# EasyEDA Pro project ProPrj_Transistörle Led Kontrol Devresi_2025-12-10.epro

# Schematic Schematic1
Board Name: Board1; Create Date: 2025-12-10; Page Name: P1; Project Name: Transistörle Led Kontrol Devresi; Schematic Name: Schematic1; Update Date: 2025-12-10; Company: EasyEDA.com; Page Size: A4; Version: V1.0
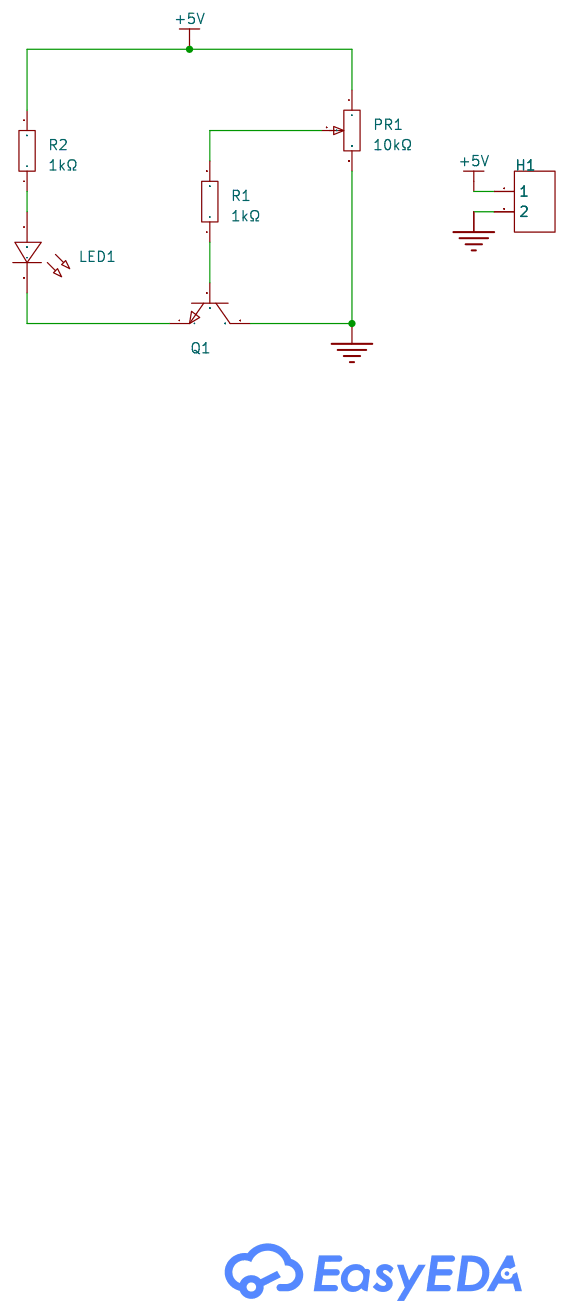
[diagram p0: schematic sheet]

## Parts
H1  -  [HDR-TH_2P-P2.54-V-F]
LED1  -  [LED_TH-3mm]
PR1  10kΩ  [R_3296]
Q1  -  [S8050_TO_92]
R1  1kΩ  [Res_1/4W]
R2  1kΩ  [Res_1/4W]

## Library data of the parts
H1 = HDR-F_2.54_1x2P: Holes Structure:1x2P Pitch:2.54mm Row Spacing:- Mounting Type:Straight Number of Rows:Plugin Number of Holes:2P Insulation Height:- Contact Material:- Contact Plating:-; Supplier Part: C49661; Supplier Footprint: 插件; Holes Structure: 1x2P; Pitch: 2.54mm; Mounting Type: Straight; Number of Rows: Plugin; Number of Holes: 2P; Supplier: LCSC; Manufacturer: BOOMELE(博穆精密); Manufacturer Part: 2.54-1*2P母; JLCPCB Part Class: Extended Part
LED1 = LED_TH-R_3mm: Supplier Footprint: 插件
PR1 = R_3296: Supplier Footprint: 直插
Q1 = S8050_TO_NPN: Supplier Footprint: TO-92
R1 R2 = Res_AXIAL-1/4W: Supplier Footprint: 轴向引线

## Nets
+5V: H1.1 PR1.1 R2.2
GND: H1.2 PR1.3 Q1.3(C)
Net-(LED1-1): LED1.1(C) R2.1
Net-(LED1-2): LED1.2(A) Q1.1(E)
Net-(PR1-2): PR1.2 R1.2
Net-(Q1-2): Q1.2(B) R1.1

# Board PCB1
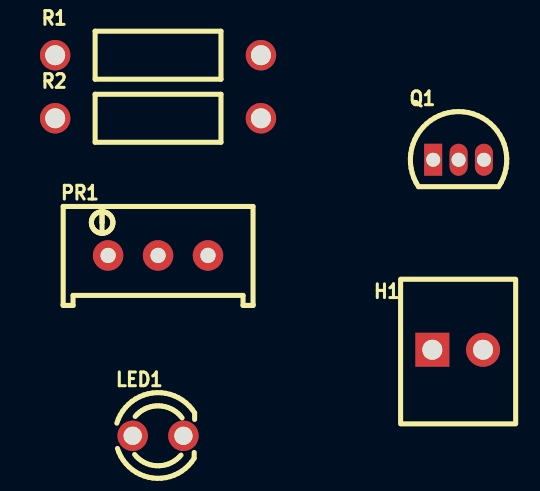
[diagram p1: board, top side]
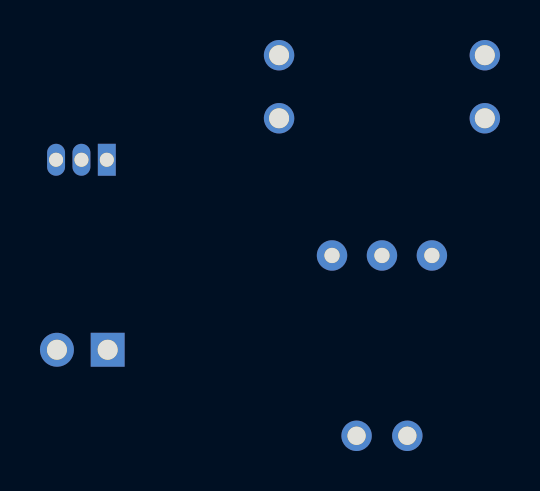
[diagram p2: board, bottom side, seen from below]

No outline. copper layers: Top Layer, Bottom Layer. Coordinates in mm from the lowest, leftmost part position.
Stack: Top Layer 0.035mm / Dielectric1 1.51mm FR4 er 4.5 / Bottom Layer 0.035mm

## Design rules (mm)
template: JLCPCB Capability(Two Layers Board)
spacing copperThickness1oz (default): track to track 0.102, other pairs 0.152 to 0.3
spacing copperThickness2oz: track to track 0.203, other pairs 0.152 to 0.3
track width copperThickness1oz (default): min 0.127, default 0.254, max 2.54
track width copperThickness2oz: min 0.203, default 0.254, max 2.54
differential pair differentialPair (default): width min 0.127, default 0.254, max 2.54; gap min 0.152, default 0.152
via viaSize (default): diameter min 0.5, default 0.61, max 10; hole min 0.3, default 0.305, max 6.3

## Placement (name value [footprint] x y rotation side)
H1  -  [HDR-TH_2P-P2.54-V-F]  15 4.3 0 top
LED1  -  [LED_TH-3mm]  0 0 0 top
PR1  10kΩ  [R_3296]  0 9.15 0 top
Q1  -  [S8050_TO_92]  15.04 13.81 0 top
R1  1kΩ  [Res_1/4W]  0 19.04 0 top
R2  1kΩ  [Res_1/4W]  0 15.88 0 top

## Footprints (pads in the part's own frame, mm; a bottom-side part is the same pattern mirrored in y, then rotated)
HDR-TH_2P-P2.54-V-F
  rect 1.7x1.7 hole 1: 1(-1.27,0)
  round 1.7 hole 1: 2(1.27,0)
LED_TH-3mm
  round 1.524 hole 0.914: 1(-1.27,0) 2(1.27,0)
R_3296
  round 1.524 hole 0.762: 1(-2.499,-0.127) 2(0,-0.127) 3(2.499,-0.127)
Res_1/4W
  round 1.524 hole 1: 1(-5.15,0) 2(5.15,0)
S8050_TO_92
  rect 0.899x1.6 hole 0.701: 1(-1.27,0)
  oval 0.899x1.6 hole 0.701: 2(0,0) 3(1.27,0)

## Nets
As in the schematic.

Pads without a net: H1 1 2; LED1 1 2; PR1 1 2 3; Q1 1 2 3; R1 1 2; R2 1 2
